# EasyEDA schematic SCH_ProtoDuck_v1_2026-04-04.json
TITLE: Sheet_1; REV: 1.0; Date: 2026-03-23; Sheet: 1/1; Drawn By: mahankuda.priyadarshan; Company: Your Company
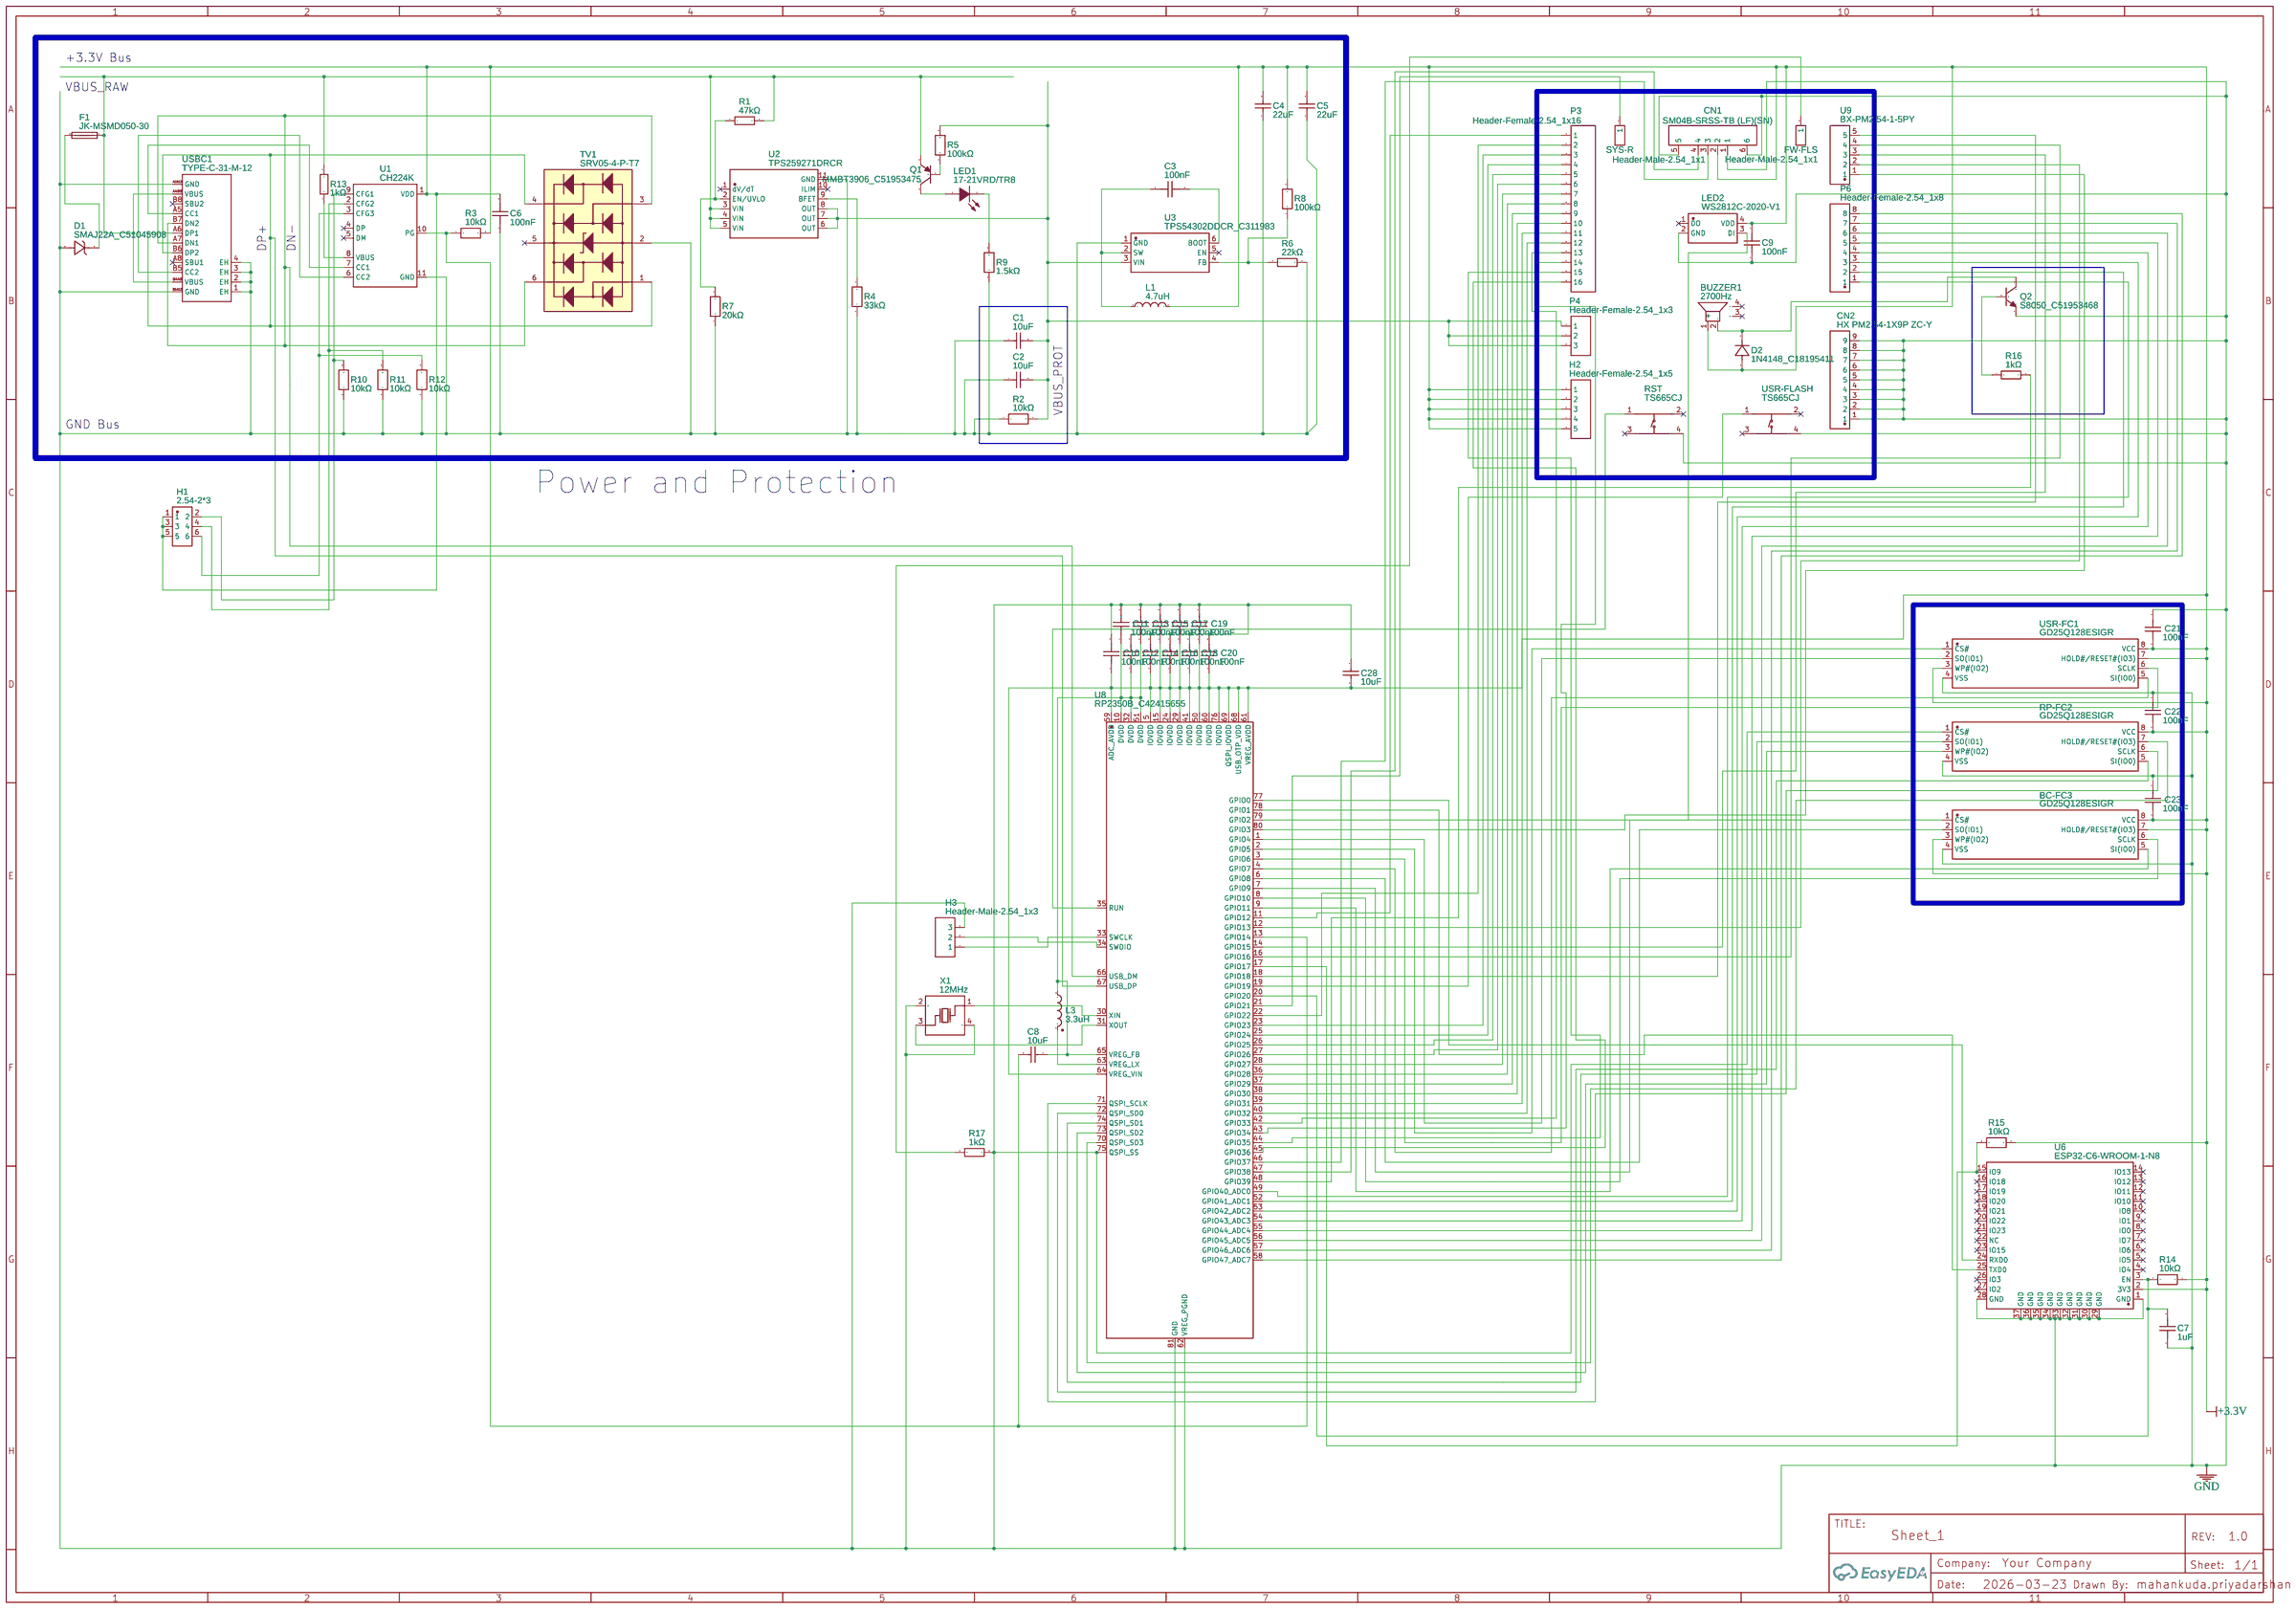
[diagram p0: schematic sheet]

## Parts
BC-FC3  GD25Q128ESIGR  [SOP-8_L5.3-W5.3-P1.27-LS8.0-BL]
BUZZER1  2700Hz  [BUZ-SMD_4P-L8.5-W8.5-P8.50-TL]
C1  10uF  [C1206]
C2  10uF  [C1206]
C3  100nF  [C0603]
C4  22uF  [C0805]
C5  22uF  [C0805]
C6  100nF  [C0402]
C7  1uF  [C0603]
C8  10uF  [C1206]
C9  100nF  [C0402]
C10  100nF  [C0402]
C11  100nF  [C0402]
C12  100nF  [C0402]
C13  100nF  [C0402]
C14  100nF  [C0402]
C15  100nF  [C0402]
C16  100nF  [C0402]
C17  100nF  [C0402]
C18  100nF  [C0402]
C19  100nF  [C0402]
C20  100nF  [C0402]
C21  100nF  [C0402]
C22  100nF  [C0402]
C23  100nF  [C0402]
C28  10uF  [C0402]
CN1  SM04B-SRSS-TB (LF)(SN)  [CONN-SMD_4P-P1.00_SM04B-SRSS-TB-LF-SN]
CN2  HX PM2.54-1X9P ZC-Y  [HDR-TH_9P-P2.54-V-F-1]
D1  SMAJ22A_C51045908  [DO-214AC_L4.3-W2.7-LS5.3-RD]
D2  1N4148_C18195411  [DO-35_BD2.2-L4.0-D0.50_1N4148]
F1  JK-MSMD050-30  [F1812]
FW-FLS  Header-Male-2.54_1x1  [HDR-TH_1P-P2.54-V-M]
H1  2.54-2*3  [HDR-TH_6P-P2.54-V-R2-C3-S2.54_A2541WV-2X3P]
H2  Header-Female-2.54_1x5  [HDR-TH_5P-P2.54-V-F]
H3  Header-Male-2.54_1x3  [HDR-TH_3P-P2.54-V-M-1]
L1  4.7uH  [IND-SMD_L6.0-W6.0]
L3  3.3uH  [IND-SMD_L2.0-W1.6_AOTA-B201610S3R3-101-T]
LED1  17-21VRD/TR8  [LED0805-R-RD]
LED2  WS2812C-2020-V1  [LED-SMD_4P-L2.0-W2.0-TL_WS2812B-2020]
P3  Header-Female-2.54_1x16  [HDR-TH_16P-P2.54-V-F-1]
P4  Header-Female-2.54_1x3  [HDR-TH_3P-P2.54-V-F]
P6  Header-Female-2.54_1x8  [HDR-TH_8P-P2.54-V-F]
Q1  MMBT3906_C51953475  [SOT-23-3_L2.9-W1.3-P1.90-LS2.4-BR]
Q2  S8050_C51953468  [SOT-23-3_L2.9-W1.3-P1.90-LS2.4-BR]
R1  47kΩ  [R0603]
R2  10kΩ  [R0603]
R3  10kΩ  [R0603]
R4  33kΩ  [R0603]
R5  100kΩ  [R0603]
R6  22kΩ  [R0402]
R7  20kΩ  [R0603]
R8  100kΩ  [R0603]
R9  1.5kΩ  [R2512]
R10  10kΩ  [R0603]
R11  10kΩ  [R0603]
R12  10kΩ  [R0603]
R13  1kΩ  [R0603]
R14  10kΩ  [R0603]
R15  10kΩ  [R0603]
R16  1kΩ  [R0603]
R17  1kΩ  [R0603]
RP-FC2  GD25Q128ESIGR  [SOP-8_L5.3-W5.3-P1.27-LS8.0-BL]
RST  TS665CJ  [SW-TH_4P-L6.0-W6.0-P4.50-LS6.5]
SYS-R  Header-Male-2.54_1x1  [HDR-TH_1P-P2.54-V-M]
TV1  SRV05-4-P-T7  [SOT-23-6_L2.9-W1.6-P0.95-LS2.8-BR]
U1  CH224K  [ESSOP-10_L4.9-W3.9-P1.0-LS6.0-TL-EP]
U2  TPS259271DRCR  [VSON-10_L3.0-W3.0-P0.50-TL-EP]
U3  TPS54302DDCR_C311983  [SOT-23-6_L2.9-W1.6-P0.95-LS2.8-BL]
U6  ESP32-C6-WROOM-1-N8  [WIRELM-SMD_ESP32-C6-WROOM-1]
U8  RP2350B_C42415655  [QFN-80_L10.0-W10.0-P0.40-TL-EP3.4]
U9  BX-PM2.54-1-5PY  [HDR-TH_5P-P2.54-V-F-B]
USBC1  TYPE-C-31-M-12  [USB-C_SMD-TYPE-C-31-M-12_1]
USR-FC1  GD25Q128ESIGR  [SOP-8_L5.3-W5.3-P1.27-LS8.0-BL]
USR-FLASH  TS665CJ  [SW-TH_4P-L6.0-W6.0-P4.50-LS6.5]
X1  12MHz  [CRYSTAL-SMD_4P-L3.2-W2.5-BL]

## Library data of the parts
BC-FC3 RP-FC2 USR-FC1 = GD25Q128ESIGR: Contributor: LCSC; Supplier: LCSC; Supplier Part: C2928891; Manufacturer: GigaDevice(兆易创新); JLCPCB Part Class: Extended Part
BUZZER1 = MLT-8540H: Supplier: LCSC; Manufacturer: 华能; Supplier Part: C95298; JLCPCB Part Class: Extended Part
C1 C2 C8 = CL31A106KBHNNNE: Supplier: LCSC; Manufacturer: SAMSUNG(三星); Supplier Part: C13585; JLCPCB Part Class: Basic Part
C3 = CC0603KRX7R9BB104: Supplier: LCSC; Manufacturer: YAGEO(国巨); Supplier Part: C14663; JLCPCB Part Class: Basic Part
C4 C5 = CL21A226MOQNNNE: Supplier: LCSC; Manufacturer: SAMSUNG(三星); Supplier Part: C98190; JLCPCB Part Class: Extended Part
C6 = CL05B104KB54PNC: Contributor: LCSC; Supplier: LCSC; Supplier Part: C307331; Manufacturer: SAMSUNG(三星); JLCPCB Part Class: Basic Part
C7 = CL10B105KB8NQNC: Contributor: lcsc; Supplier: LCSC; Supplier Part: C5199872; Manufacturer: SAMSUNG(三星); JLCPCB Part Class: Extended Part
C9-C23 = CL05B104KO5NNNC: Supplier: LCSC; Manufacturer: SAMSUNG(三星); Supplier Part: C1525; JLCPCB Part Class: Basic Part
C28 = CL05A106MQ5NUNC: Supplier: LCSC; Manufacturer: SAMSUNG(三星); Supplier Part: C15525; JLCPCB Part Class: Basic Part
CN1 = SM04B-SRSS-TB (LF)(SN): Contributor: LCSC; Supplier: LCSC; Supplier Part: C160404; Manufacturer: JST; Manufacturer Part: SM04B-SRSS-TB(LF)(SN); JLCPCB Part Class: Extended Part
CN2 = HX PM2.54-1X9P ZC-Y: Supplier: LCSC; Supplier Part: C22438159; Manufacturer: hanxia(韩下); Manufacturer Part: HX PM2.54-1x9P ZC-Y; Contributor: lcsc; JLCPCB Part Class: Extended Part
D1 = SMAJ22A_C51045908: Supplier: LCSC; Supplier Part: C51045908; Manufacturer: Brightking(君耀电子); Manufacturer Part: SMAJ22A; Contributor: lcsc; JLCPCB Part Class: Extended Part
D2 = 1N4148_C18195411: Supplier: LCSC; Supplier Part: C18195411; Manufacturer: LJ(朗捷); Manufacturer Part: 1N4148; JLCPCB Part Class: Extended Part; Contributor: lcsc
F1 = JK-MSMD050-30: Contributor: LCSC; Supplier: LCSC; Supplier Part: C369168; Manufacturer: JK(金科); JLCPCB Part Class: Extended Part
FW-FLS SYS-R = Header-Male-2.54_1x1: Supplier: LCSC; Manufacturer: BOOMELE(博穆精密); Manufacturer Part: 2.54-1*1P针; Supplier Part: C81276; JLCPCB Part Class: Extended Part
H1 = 2.54-2*3: Supplier: LCSC; Supplier Part: C5116479; Manufacturer: ZHOURI(洲日); JLCPCB Part Class: Extended Part; Contributor: lcsc
H2 = Header-Female-2.54_1x5: Supplier: LCSC; Manufacturer: BOOMELE(博穆精密); Manufacturer Part: 2.54-1*5P母; Supplier Part: C50950; JLCPCB Part Class: Extended Part
H3 = Header-Male-2.54_1x3: Supplier: LCSC; Manufacturer: BOOMELE(博穆精密); Manufacturer Part: 2.54-1*3P针; Supplier Part: C49257; JLCPCB Part Class: Extended Part
L1 = CKCS6045-4.7UH/M: Supplier: LCSC; Supplier Part: C5291878; Manufacturer: CENKER(岑科); Manufacturer Part: CKCS6045-4.7uH/M; JLCPCB Part Class: Extended Part; Contributor: lcsc
L3 = AOTA-B201610S3R3-101-T: Supplier: LCSC; Supplier Part: C42411119; Manufacturer: ABRACON; JLCPCB Part Class: Extended Part; Contributor: lcsc
LED1 = 17-21VRD/TR8: Contributor: LCSC; Supplier: LCSC; Supplier Part: C264415; Manufacturer: EVERLIGHT(亿光); JLCPCB Part Class: Extended Part
LED2 = WS2812C-2020-V1: Contributor: lcsc; Supplier: LCSC; Supplier Part: C2976072; Manufacturer: worldsemi; JLCPCB Part Class: Extended Part
P3 = Header-Female-2.54_1x16: Supplier: LCSC; Manufacturer: BOOMELE(博穆精密); Manufacturer Part: 2.54-1*16P母; Supplier Part: C66987; JLCPCB Part Class: Extended Part
P4 = Header-Female-2.54_1x3: Supplier Part: C146243; Supplier: LCSC; Manufacturer: BOOMELE(博穆精密); Manufacturer Part: 2.54-1*3P母; JLCPCB Part Class: Extended Part
P6 = Header-Female-2.54_1x8: Supplier: LCSC; Manufacturer: BOOMELE(博穆精密); Manufacturer Part: 2.54-1*8P母环保; Supplier Part: C27438; JLCPCB Part Class: Extended Part
Q1 = MMBT3906_C51953475: Supplier: LCSC; Supplier Part: C51953475; Manufacturer: CCX(晁禾); Manufacturer Part: MMBT3906; Contributor: lcsc; JLCPCB Part Class: Extended Part
Q2 = S8050_C51953468: Supplier: LCSC; Supplier Part: C51953468; Manufacturer: CCX(晁禾); Manufacturer Part: S8050; Contributor: lcsc; JLCPCB Part Class: Extended Part
R1 = 0603WAF4702T5E: Supplier: LCSC; Manufacturer: UNI-ROYAL(厚声); Supplier Part: C25819; JLCPCB Part Class: Basic Part
R2 R3 R10-R12 R14 R15 = FRC0603J103TS: Contributor: LCSC; Supplier: LCSC; Supplier Part: C2930027; Manufacturer: FOJAN(富捷); Manufacturer Part: FRC0603J103 TS; JLCPCB Part Class: Extended Part
R4 = FRC0603F3302TS: Supplier: LCSC; Supplier Part: C2907028; Manufacturer: FOJAN(富捷); Contributor: lcsc; JLCPCB Part Class: Extended Part
R5 = FRC0603J104 TS: Contributor: lcsc; Supplier: LCSC; Supplier Part: C2907088; Manufacturer: FOJAN(富捷); JLCPCB Part Class: Extended Part
R6 = 0402WGF2202TCE: Supplier: LCSC; Manufacturer: UNI-ROYAL(厚声); Supplier Part: C25768; JLCPCB Part Class: Basic Part
R7 = FRC0603F2002TS: Contributor: lcsc; Supplier: LCSC; Supplier Part: C2907011; Manufacturer: FOJAN(富捷); JLCPCB Part Class: Extended Part
R8 = FCR0603F100K: Supplier: LCSC; Supplier Part: C5913165; Manufacturer: VO(翔胜); Contributor: lcsc; JLCPCB Part Class: Extended Part
R9 = FRC2512F1501TS: Supplier: LCSC; Supplier Part: C5153994; Manufacturer: FOJAN(富捷); JLCPCB Part Class: Extended Part; Contributor: lcsc
R13 R16 R17 = 0603WAF1001T5E: Supplier: LCSC; Manufacturer: UNI-ROYAL(厚声); Supplier Part: C21190; JLCPCB Part Class: Basic Part
RST USR-FLASH = TS665CJ: Contributor: LCSC; Supplier: LCSC; Supplier Part: C393938; Manufacturer: SHOU HAN(首韩); JLCPCB Part Class: Extended Part
TV1 = SRV05-4-P-T7: Supplier: LCSC; Manufacturer: PROTEK; Supplier Part: C85364; JLCPCB Part Class: Extended Part
U1 = CH224K: Contributor: lcsc; Supplier: LCSC; Supplier Part: C970725; Manufacturer: WCH(南京沁恒); JLCPCB Part Class: Extended Part
U2 = TPS259271DRCR: Supplier: LCSC; Supplier Part: C2653851; Manufacturer: TI(德州仪器); JLCPCB Part Class: Extended Part; Contributor: lcsc
U3 = TPS54302DDCR_C311983: Contributor: LCSC; Supplier: LCSC; Supplier Part: C311983; Manufacturer: TI(德州仪器); Manufacturer Part: TPS54302DDCR; JLCPCB Part Class: Extended Part
U6 = ESP32-C6-WROOM-1-N8: Supplier: LCSC; Supplier Part: C5366877; Manufacturer: ESPRESSIF(乐鑫); Contributor: lcsc; JLCPCB Part Class: Extended Part
U8 = RP2350B_C42415655: Supplier: LCSC; Supplier Part: C42415655; Manufacturer: Raspberry Pi(树莓派); Manufacturer Part: RP2350B; JLCPCB Part Class: Extended Part; Contributor: lcsc
U9 = BX-PM2.54-1-5PY: Supplier: LCSC; Supplier Part: C18078128; Manufacturer: Bossie(博锡); Contributor: lcsc; JLCPCB Part Class: Extended Part
USBC1 = TYPE-C-31-M-12: Contributor: LCSC; Supplier: LCSC; Supplier Part: C165948; Manufacturer: 韩国韩荣; JLCPCB Part Class: Extended Part
X1 = X322512MSB4SI: Supplier: LCSC; Manufacturer: YXC(扬兴晶振); Supplier Part: C9002; JLCPCB Part Class: Basic Part

## Nets
+3.3V: BC-FC3.3(WP#(IO2)) BC-FC3.7(HOLD#/RESET#(IO3)) BC-FC3.8(VCC) BUZZER1.1(+) C4.2 C5.2 C6.2 C9.2 C10.1 C14.1 C15.1 C16.1 C17.1 C18.1 C19.1 C20.1 C21.1 C22.1 C23.1 C28.1 CN1.2 D2.1(A) H1.1 H1.3 H1.5 H2.1 H2.2 H2.3 H2.4 H2.5 L1.2 LED2.4(VDD) R3.2 R8.2 R14.1 R15.1 RP-FC2.8(VCC) U1.1(VDD) U6.2(3V3) U8.5(IOVDD) U8.15(IOVDD) U8.24(IOVDD) U8.29(IOVDD) U8.41(IOVDD) U8.50(IOVDD) U8.59(ADC_AVDD) U8.60(IOVDD) U8.61(VREG_AVDD) U8.64(VREG_VIN) U8.68(USB_OTP_VDD) U8.69(QSPI_IOVDD) U8.76(IOVDD) USR-FC1.3(WP#(IO2)) USR-FC1.7(HOLD#/RESET#(IO3)) USR-FC1.8(VCC)
GND: BC-FC3.4(VSS) C1.1 C2.1 C4.1 C5.1 C6.1 C7.2 C9.1 C10.2 C11.2 C12.2 C13.2 C14.2 C15.2 C16.2 C17.2 C18.2 C19.2 C20.2 C21.2 C22.2 C23.2 C28.2 CN1.1 CN1.5 CN1.6 CN2.1 CN2.2 CN2.3 CN2.4 CN2.5 CN2.6 CN2.7 CN2.8 CN2.9 D1.2(A) H3.3 LED2.2(GND) Q2.2(E) R2.1 R4.1 R6.2 R7.1 R9.1 R10.1 R11.1 R12.1 R17.2 RP-FC2.1(CS#) RP-FC2.4(VSS) RST.4(D) TV1.2 U1.11(GND) U2.11(GND) U3.1(GND) U6.1(GND) U6.28(GND) U6.29(GND) U6.30(GND) U6.31(GND) U6.32(GND) U6.33(GND) U6.34(GND) U6.35(GND) U6.36(GND) U6.37(GND) U8.62(VREG_PGND) U8.75(QSPI_SS) U8.81(GND) USBC1.1(EH) USBC1.2(EH) USBC1.3(EH) USBC1.4(EH) USBC1.A1B12(GND) USBC1.B1A12(GND) USR-FC1.4(VSS) USR-FLASH.4(D) X1.2(GND) X1.4(GND)
Net-(BC-FC3-1): BC-FC3.1(CS#) U8.7(GPIO9)
Net-(BC-FC3-2): BC-FC3.2(SO(IO1)) U8.6(GPIO8)
Net-(BC-FC3-5): BC-FC3.5(SI(IO0)) U8.9(GPIO11)
Net-(BC-FC3-6): BC-FC3.6(SCLK) U8.8(GPIO10)
Net-(BUZZER1-2): BUZZER1.2 D2.2(C) Q2.3(C)
Net-(C1-2): C1.2 C2.2 P4.1 P4.2 P4.3 R2.2 R5.2 U2.6(OUT) U2.7(OUT) U2.8(OUT) U3.3(VIN)
Net-(C3-1): C3.1 L1.1 U3.2(SW)
Net-(C3-2): C3.2 U3.6(BOOT)
Net-(C7-1): C7.1 R14.2 U6.3(EN) U8.20(GPIO20)
Net-(C8-1): C8.1 R3.1 U1.10(PG) U8.13(GPIO14)
Net-(C8-2): C8.2 C11.1 C12.1 C13.1 L3.1 U8.10(DVDD) U8.32(DVDD) U8.51(DVDD) U8.65(VREG_FB)
Net-(CN1-3): CN1.3 U8.46(GPIO37)
Net-(CN1-4): CN1.4 U8.47(GPIO38)
Net-(D1-1): D1.1(K) F1.2
Net-(F1-1): F1.1 Q1.2(E) R1.2 R13.2 U2.3(VIN) U2.4(VIN) U2.5(VIN) USBC1.A4B9(VBUS) USBC1.B4A9(VBUS)
Net-(FW-FLS-1): FW-FLS.1 R17.1
Net-(H1-2): H1.2 R10.2 U1.9(CFG1)
Net-(H1-4): H1.4 R11.2 U1.2(CFG2)
Net-(H1-6): H1.6 R12.2 U1.3(CFG3)
Net-(H3-1): H3.1 U8.33(SWCLK)
Net-(H3-2): H3.2 U8.34(SWDIO)
Net-(L3-2): L3.2 U8.63(VREG_LX)
Net-(LED1-1): LED1.1(A) Q1.3(C)
Net-(LED1-2): LED1.2(K) R9.2
Net-(LED2-3): LED2.3(DI) U8.79(GPIO2)
Net-(P3-1): P3.1 U8.11(GPIO12)
Net-(P3-2): P3.2 U8.22(GPIO22)
Net-(P3-3): P3.3 U8.23(GPIO23)
Net-(P3-4): P3.4 U8.25(GPIO24)
Net-(P3-5): P3.5 U8.26(GPIO25)
Net-(P3-6): P3.6 U8.27(GPIO26)
Net-(P3-7): P3.7 U8.28(GPIO27)
Net-(P3-8): P3.8 U8.36(GPIO28)
Net-(P3-9): P3.9 U8.37(GPIO29)
Net-(P3-10): P3.10 U8.38(GPIO30)
Net-(P3-11): P3.11 U8.39(GPIO31)
Net-(P3-12): P3.12 U8.40(GPIO32)
Net-(P3-13): P3.13 U8.42(GPIO33)
Net-(P3-14): P3.14 U8.43(GPIO34)
Net-(P3-15): P3.15 U8.44(GPIO35)
Net-(P3-16): P3.16 U8.45(GPIO36)
Net-(P6-1): P6.1 U8.49(GPIO40_ADC0)
Net-(P6-2): P6.2 U8.52(GPIO41_ADC1)
Net-(P6-3): P6.3 U8.53(GPIO42_ADC2)
Net-(P6-4): P6.4 U8.54(GPIO43_ADC3)
Net-(P6-5): P6.5 U8.55(GPIO44_ADC4)
Net-(P6-6): P6.6 U8.56(GPIO45_ADC5)
Net-(P6-7): P6.7 U8.57(GPIO46_ADC6)
Net-(P6-8): P6.8 U8.58(GPIO47_ADC7)
Net-(Q1-1): Q1.1(B) R5.1
Net-(Q2-1): Q2.1(B) R16.1
Net-(R1-1): R1.1 R7.2 U2.2(EN/UVLO)
Net-(R4-2): R4.2 U2.9(BFET)
Net-(R6-1): R6.1 R8.1 U3.4(FB)
Net-(R13-1): R13.1 U1.8(VBUS)
Net-(R15-2): R15.2 U6.15(IO9) U8.17(GPIO17)
Net-(R16-2): R16.2 U8.48(GPIO39)
Net-(RP-FC2-2): RP-FC2.2(SO(IO1)) U8.74(QSPI_SD1)
Net-(RP-FC2-3): RP-FC2.3(WP#(IO2)) U8.73(QSPI_SD2)
Net-(RP-FC2-5): RP-FC2.5(SI(IO0)) U8.72(QSPI_SD0)
Net-(RP-FC2-6): RP-FC2.6(SCLK) U8.71(QSPI_SCLK)
Net-(RP-FC2-7): RP-FC2.7(HOLD#/RESET#(IO3)) U8.70(QSPI_SD3)
Net-(RST-1): RST.1(A) U8.35(RUN)
Net-(SYS-R-1): SYS-R.1 U8.21(GPIO21)
Net-(TV1-1): TV1.1 TV1.4 U8.67(USB_DP) USBC1.A6(DP1) USBC1.B6(DP2)
Net-(TV1-3): TV1.3 TV1.6 U8.66(USB_DM) USBC1.A7(DN1) USBC1.B7(DN2)
Net-(U1-6): U1.6(CC2) USBC1.B5(CC2)
Net-(U1-7): U1.7(CC1) USBC1.A5(CC1)
Net-(U6-24): U6.24(RXD0) U8.77(GPIO0)
Net-(U6-25): U6.25(TXD0) U8.78(GPIO1)
Net-(U8-1): U8.1(GPIO4) USR-FC1.2(SO(IO1))
Net-(U8-2): U8.2(GPIO5) USR-FC1.1(CS#)
Net-(U8-3): U8.3(GPIO6) USR-FC1.6(SCLK)
Net-(U8-4): U8.4(GPIO7) USR-FC1.5(SI(IO0))
Net-(U8-12): U8.12(GPIO13) U9.2
Net-(U8-14): U8.14(GPIO15) U9.3
Net-(U8-16): U8.16(GPIO16) U9.4
Net-(U8-18): U8.18(GPIO18) U9.5
Net-(U8-19): U8.19(GPIO19) USR-FLASH.1(A)
Net-(U8-30): U8.30(XIN) X1.1(OSC1)
Net-(U8-31): U8.31(XOUT) X1.3(OSC2)
Net-(U8-80): U8.80(GPIO3) U9.1

Not connected (* = marked no-connect by the designer): BUZZER1 3(NC)* 4(NC)*; LED2 1(DO)*; RST 2(B)* 3(C)*; TV1 5*; U1 4(DP)* 5(DM)*; U2 1(dV/dT)* 10(ILIM)*; U3 5(EN)*; U6 4(IO4)* 5(IO5)* 6(IO6)* 7(IO7)* 8(IO0)* 9(IO1)* 10(IO8)* 11(IO10)* 12(IO11)* 13(IO12)* 14(IO13)* 16(IO18)* 17(IO19)* 18(IO20)* 19(IO21)* 20(IO22)* 21(IO23)* 22(NC)* 23(IO15)* 26(IO3)* 27(IO2)*; USBC1 A8(SBU1)* B8(SBU2)*; USR-FLASH 2(B)* 3(C)*

## Notes on the sheet
- +3.3V Bus
- VBUS_RAW
- DP+
- DN-
- VBUS_PROT
- GND Bus
- Power and Protection
